# EAGLE schematic Timing_Control_V1p1 (EAGLE 9.6.2)

## Sheet 1 of 3: Main Circuitry
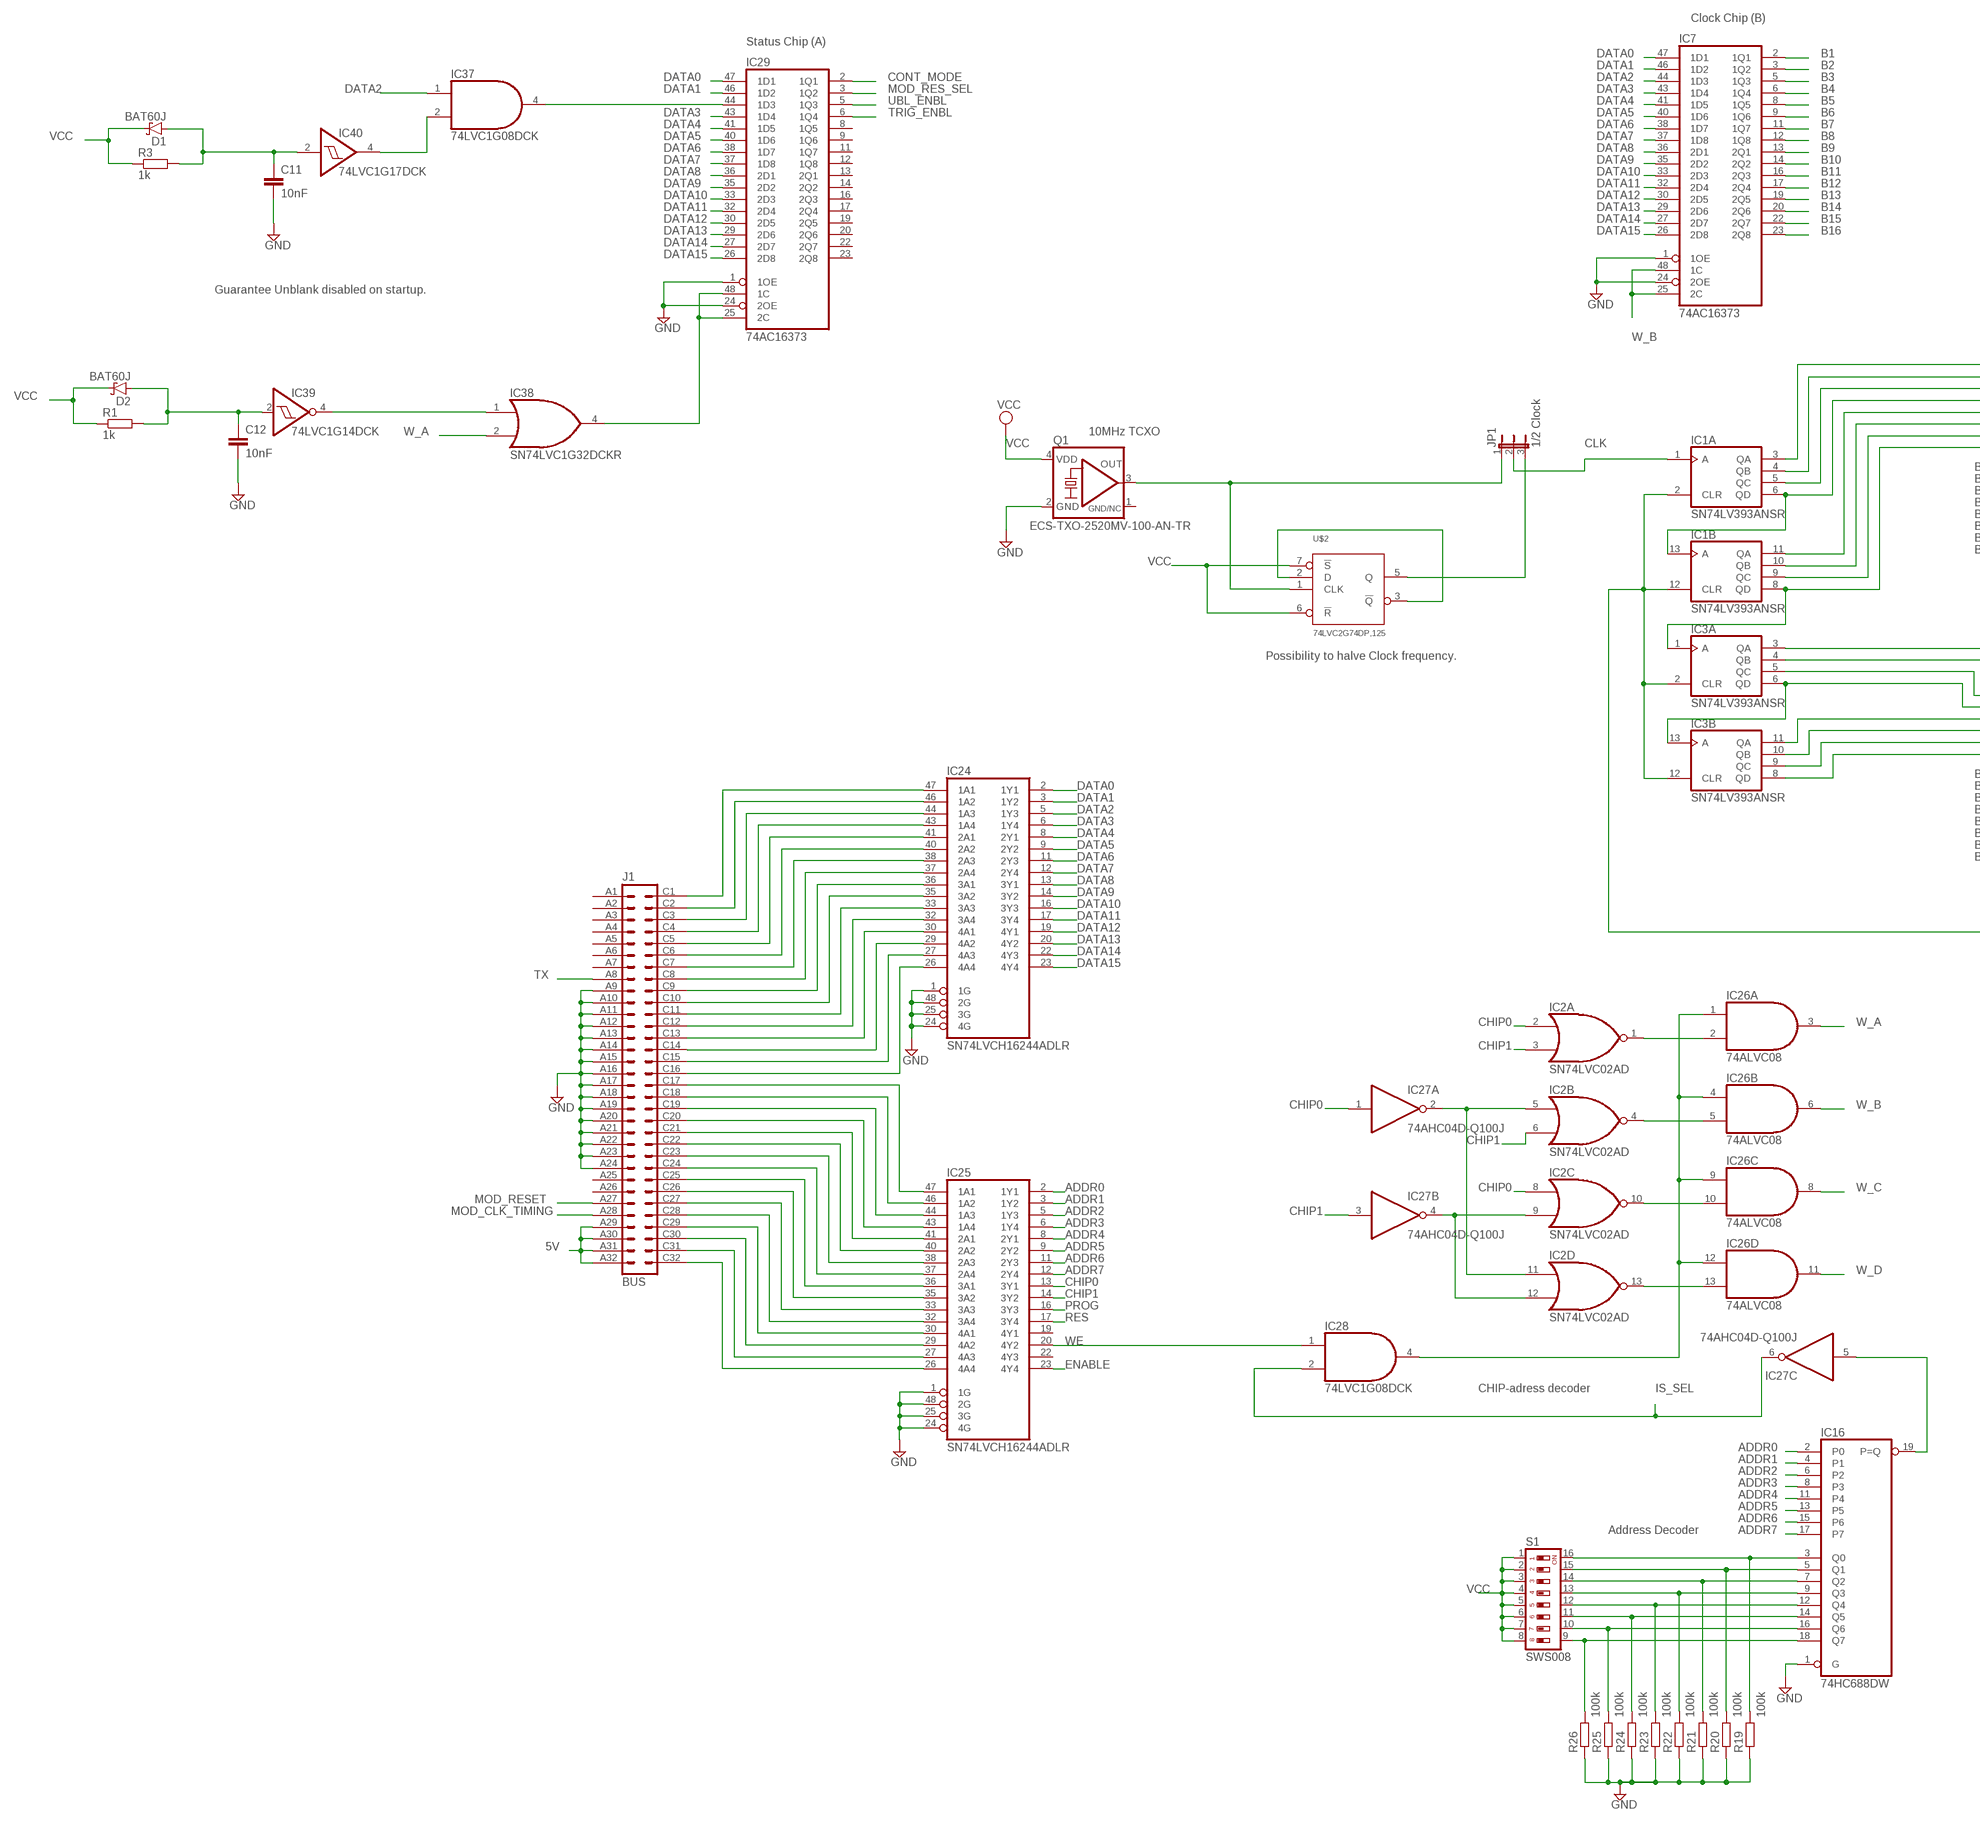
[diagram p0: schematic, sheet 1, part 1 of 3]
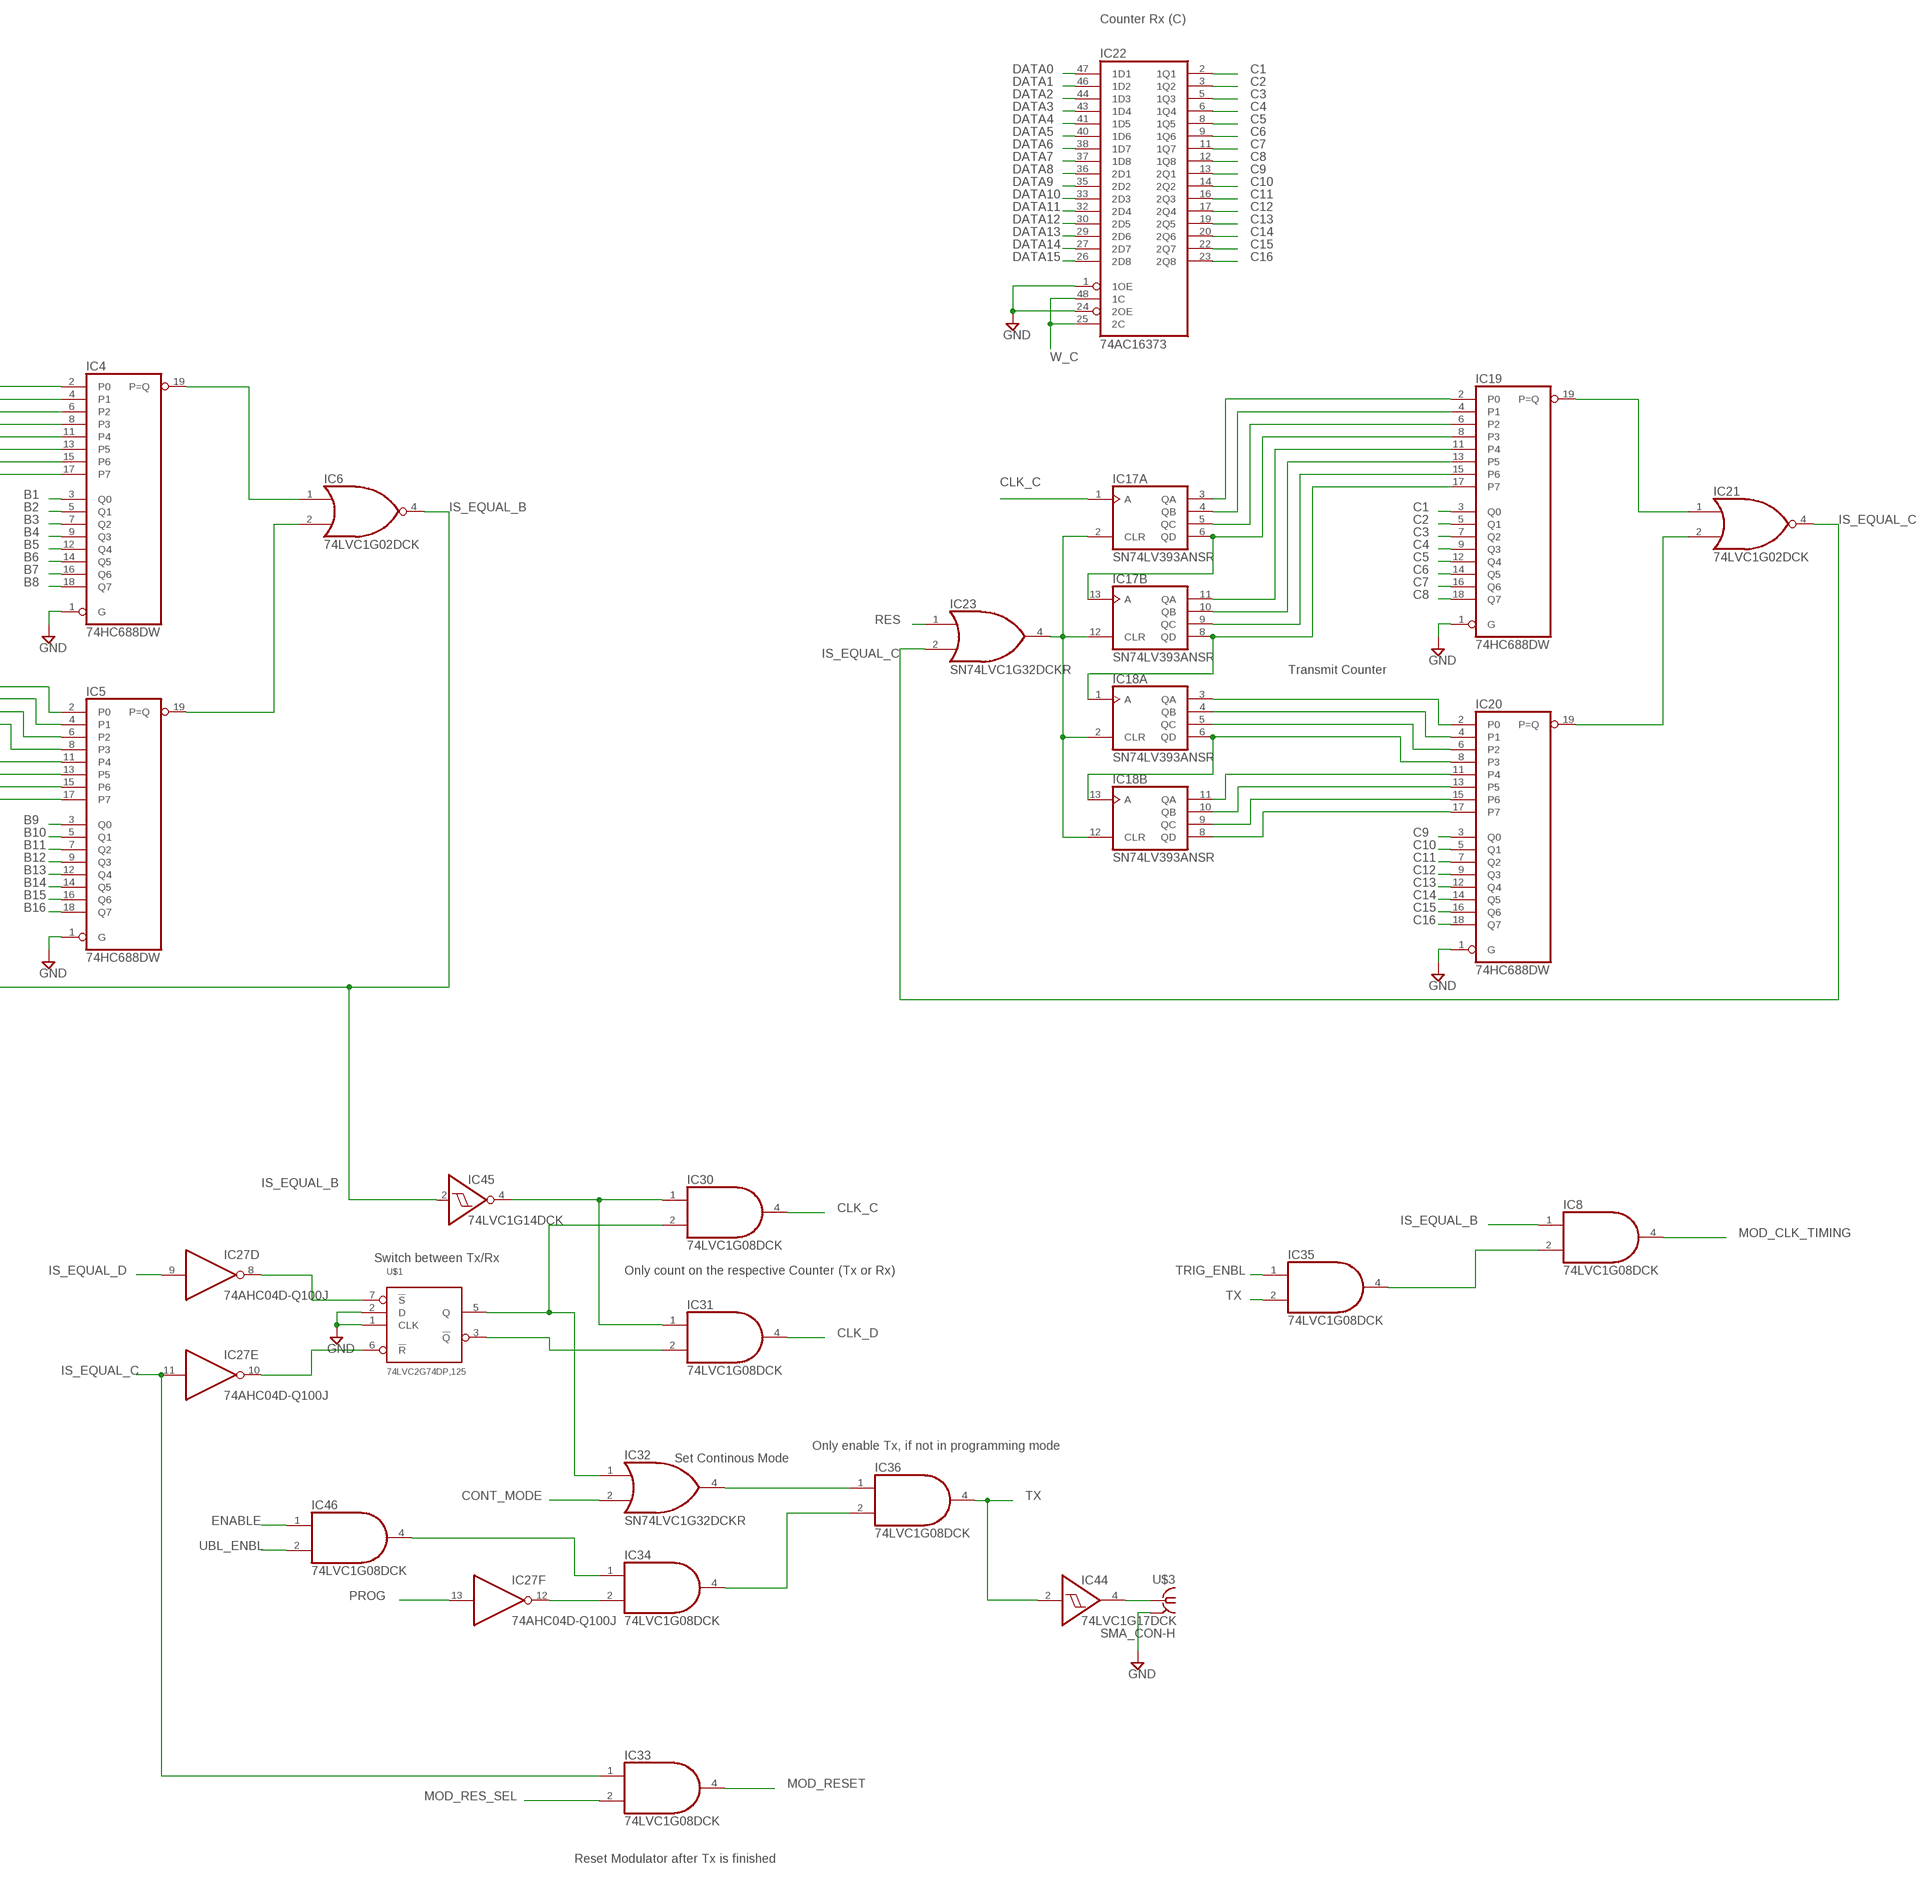
[diagram p1: schematic, sheet 1, part 2 of 3]
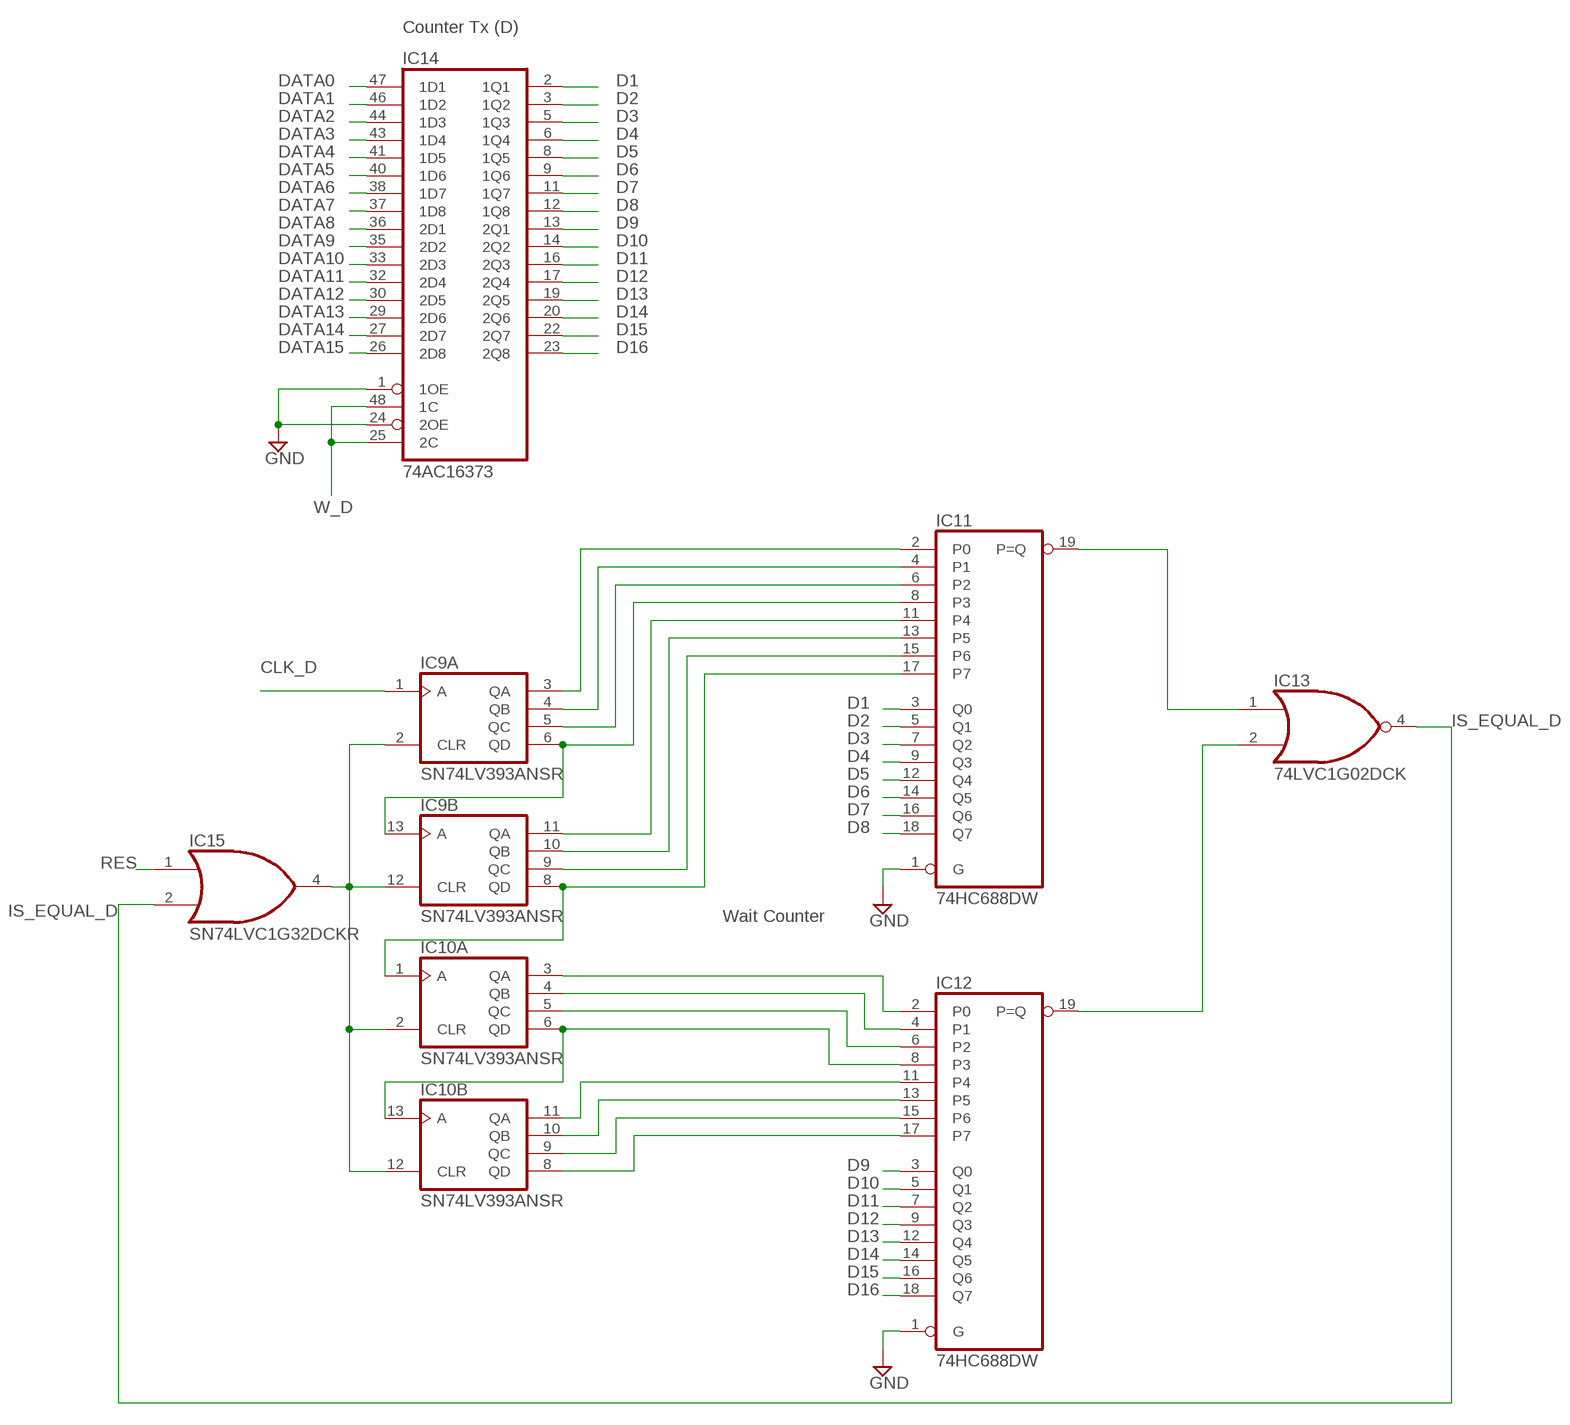
[diagram p2: schematic, sheet 1, part 3 of 3]

### Parts
C11  10nF  C-EUC0603  [C0603]
C12  10nF  C-EUC0603  [C0603]
D1  BAT60J  [SOD323_ST]
D2  BAT60J  [SOD323_ST]
IC1  SN74LV393ANSR  74AC393D  [SO14]
IC2  SN74LVC02AD  74AS02D  [SO14]
IC3  SN74LV393ANSR  74AC393D  [SO14]
IC4  74HC688DW  [SO20W]
IC5  74HC688DW  [SO20W]
IC6  74LVC1G02DCK  [SC70-5]
IC7  74AC16373  [SSOP48DL]
IC8  74LVC1G08DCK  [SC70-5]
IC9  SN74LV393ANSR  74AC393D  [SO14]
IC10  SN74LV393ANSR  74AC393D  [SO14]
IC11  74HC688DW  [SO20W]
IC12  74HC688DW  [SO20W]
IC13  74LVC1G02DCK  [SC70-5]
IC14  74AC16373  [SSOP48DL]
IC15  SN74LVC1G32DCKR  74AUC1G32DCK  [SC70-5]
IC16  74HC688DW  [SO20W]
IC17  SN74LV393ANSR  74AC393D  [SO14]
IC18  SN74LV393ANSR  74AC393D  [SO14]
IC19  74HC688DW  [SO20W]
IC20  74HC688DW  [SO20W]
IC21  74LVC1G02DCK  [SC70-5]
IC22  74AC16373  [SSOP48DL]
IC23  SN74LVC1G32DCKR  74AUC1G32DCK  [SC70-5]
IC24  SN74LVCH16244ADLR  74AC16244  [SSOP48DL]
IC25  SN74LVCH16244ADLR  74AC16244  [SSOP48DL]
IC26  74ALVC08  74ALS08D  [SO14]
IC27  74AHC04D-Q100J  74ALS04D  [SO14]
IC28  74LVC1G08DCK  [SC70-5]
IC29  74AC16373  [SSOP48DL]
IC30  74LVC1G08DCK  [SC70-5]
IC31  74LVC1G08DCK  [SC70-5]
IC32  SN74LVC1G32DCKR  74AUC1G32DCK  [SC70-5]
IC33  74LVC1G08DCK  [SC70-5]
IC34  74LVC1G08DCK  [SC70-5]
IC35  74LVC1G08DCK  [SC70-5]
IC36  74LVC1G08DCK  [SC70-5]
IC37  74LVC1G08DCK  [SC70-5]
IC38  SN74LVC1G32DCKR  74AUC1G32DCK  [SC70-5]
IC39  74LVC1G14DCK  [SC70-5]
IC40  74LVC1G17DCK  [SC70-5]
IC44  74LVC1G17DCK  [SC70-5]
IC45  74LVC1G14DCK  [SC70-5]
IC46  74LVC1G08DCK  [SC70-5]
J1  BUS  VG64P  [VG64P]
JP1  1/2 Clock  JP2E  [JP2]
Q1  ECS-TXO-2520MV-100-AN-TR  KXO-TCXO-CMOS-86  [2.5X2.0_KXO-86-TCXO]
R1  1k  R-EU_R0603  [R0603]
R3  1k  R-EU_R0603  [R0603]
R19  100k  R-EU_R0603  [R0603]
R20  100k  R-EU_R0603  [R0603]
R21  100k  R-EU_R0603  [R0603]
R22  100k  R-EU_R0603  [R0603]
R23  100k  R-EU_R0603  [R0603]
R24  100k  R-EU_R0603  [R0603]
R25  100k  R-EU_R0603  [R0603]
R26  100k  R-EU_R0603  [R0603]
S1  SWS008  [SMS-008]
U$1  74LVC2G74DP,125  74LVC2G74  [SSOP08]
U$2  74LVC2G74DP,125  74LVC2G74  [SSOP08]
U$3  SMA_CON-H  [BU-SMA-H]

### Nets
5V: J1.A29 J1.A30 J1.A31 J1.A32 ; also sheet 3
ADDR0: IC16.2(P0) IC25.2(1Y1)
ADDR1: IC16.4(P1) IC25.3(1Y2)
ADDR2: IC16.6(P2) IC25.5(1Y3)
ADDR3: IC16.8(P3) IC25.6(1Y4)
ADDR4: IC16.11(P4) IC25.8(2Y1)
ADDR5: IC16.13(P5) IC25.9(2Y2)
ADDR6: IC16.15(P6) IC25.11(2Y3)
ADDR7: IC16.17(P7) IC25.12(2Y4)
B1: IC4.3(Q0) IC7.2(1Q1)
B2: IC4.5(Q1) IC7.3(1Q2)
B3: IC4.7(Q2) IC7.5(1Q3)
B4: IC4.9(Q3) IC7.6(1Q4)
B5: IC4.12(Q4) IC7.8(1Q5)
B6: IC4.14(Q5) IC7.9(1Q6)
B7: IC4.16(Q6) IC7.11(1Q7)
B8: IC4.18(Q7) IC7.12(1Q8)
B9: IC5.3(Q0) IC7.13(2Q1)
B10: IC5.5(Q1) IC7.14(2Q2)
B11: IC5.7(Q2) IC7.16(2Q3)
B12: IC5.9(Q3) IC7.17(2Q4)
B13: IC5.12(Q4) IC7.19(2Q5)
B14: IC5.14(Q5) IC7.20(2Q6)
B15: IC5.16(Q6) IC7.22(2Q7)
B16: IC5.18(Q7) IC7.23(2Q8)
C1: IC19.3(Q0) IC22.2(1Q1)
C2: IC19.5(Q1) IC22.3(1Q2)
C3: IC19.7(Q2) IC22.5(1Q3)
C4: IC19.9(Q3) IC22.6(1Q4)
C5: IC19.12(Q4) IC22.8(1Q5)
C6: IC19.14(Q5) IC22.9(1Q6)
C7: IC19.16(Q6) IC22.11(1Q7)
C8: IC19.18(Q7) IC22.12(1Q8)
C9: IC20.3(Q0) IC22.13(2Q1)
C10: IC20.5(Q1) IC22.14(2Q2)
C11: IC20.7(Q2) IC22.16(2Q3)
C12: IC20.9(Q3) IC22.17(2Q4)
C13: IC20.12(Q4) IC22.19(2Q5)
C14: IC20.14(Q5) IC22.20(2Q6)
C15: IC20.16(Q6) IC22.22(2Q7)
C16: IC20.18(Q7) IC22.23(2Q8)
CHIP0: IC2.2(A:I0) IC2.8(C:I0) IC25.13(3Y1) IC27.1(A:I)
CHIP1: IC2.3(A:I1) IC2.6(B:I1) IC25.14(3Y2) IC27.3(B:I)
CLK: IC1.1(A:A) JP1.2
CLK_C: IC17.1(A:A) IC30.4(O)
CLK_D: IC9.1(A:A) IC31.4(O)
CLR1: IC9.2(A:CLR) IC9.12(B:CLR) IC10.2(A:CLR) IC10.12(B:CLR) IC15.4(O)
CLR2: IC17.2(A:CLR) IC17.12(B:CLR) IC18.2(A:CLR) IC18.12(B:CLR) IC23.4(O)
CONT_MODE: IC29.2(1Q1) IC32.2(I1) ; also sheet 2
D1: IC11.3(Q0) IC14.2(1Q1)
D2: IC11.5(Q1) IC14.3(1Q2)
D3: IC11.7(Q2) IC14.5(1Q3)
D4: IC11.9(Q3) IC14.6(1Q4)
D5: IC11.12(Q4) IC14.8(1Q5)
D6: IC11.14(Q5) IC14.9(1Q6)
D7: IC11.16(Q6) IC14.11(1Q7)
D8: IC11.18(Q7) IC14.12(1Q8)
D9: IC12.3(Q0) IC14.13(2Q1)
D10: IC12.5(Q1) IC14.14(2Q2)
D11: IC12.7(Q2) IC14.16(2Q3)
D12: IC12.9(Q3) IC14.17(2Q4)
D13: IC12.12(Q4) IC14.19(2Q5)
D14: IC12.14(Q5) IC14.20(2Q6)
D15: IC12.16(Q6) IC14.22(2Q7)
D16: IC12.18(Q7) IC14.23(2Q8)
DATA0: IC7.47(1D1) IC14.47(1D1) IC22.47(1D1) IC24.2(1Y1) IC29.47(1D1)
DATA1: IC7.46(1D2) IC14.46(1D2) IC22.46(1D2) IC24.3(1Y2) IC29.46(1D2)
DATA2: IC7.44(1D3) IC14.44(1D3) IC22.44(1D3) IC24.5(1Y3) IC37.1(I0)
DATA3: IC7.43(1D4) IC14.43(1D4) IC22.43(1D4) IC24.6(1Y4) IC29.43(1D4)
DATA4: IC7.41(1D5) IC14.41(1D5) IC22.41(1D5) IC24.8(2Y1) IC29.41(1D5)
DATA5: IC7.40(1D6) IC14.40(1D6) IC22.40(1D6) IC24.9(2Y2) IC29.40(1D6)
DATA6: IC7.38(1D7) IC14.38(1D7) IC22.38(1D7) IC24.11(2Y3) IC29.38(1D7)
DATA7: IC7.37(1D8) IC14.37(1D8) IC22.37(1D8) IC24.12(2Y4) IC29.37(1D8)
DATA8: IC7.36(2D1) IC14.36(2D1) IC22.36(2D1) IC24.13(3Y1) IC29.36(2D1)
DATA9: IC7.35(2D2) IC14.35(2D2) IC22.35(2D2) IC24.14(3Y2) IC29.35(2D2)
DATA10: IC7.33(2D3) IC14.33(2D3) IC22.33(2D3) IC24.16(3Y3) IC29.33(2D3)
DATA11: IC7.32(2D4) IC14.32(2D4) IC22.32(2D4) IC24.17(3Y4) IC29.32(2D4)
DATA12: IC7.30(2D5) IC14.30(2D5) IC22.30(2D5) IC24.19(4Y1) IC29.30(2D5)
DATA13: IC7.29(2D6) IC14.29(2D6) IC22.29(2D6) IC24.20(4Y2) IC29.29(2D6)
DATA14: IC7.27(2D7) IC14.27(2D7) IC22.27(2D7) IC24.22(4Y3) IC29.27(2D7)
DATA15: IC7.26(2D8) IC14.26(2D8) IC22.26(2D8) IC24.23(4Y4) IC29.26(2D8)
ENABLE: IC25.23(4Y4) IC46.1(I0)
GND: C11.2 C12.2 IC4.1(G) IC5.1(G) IC7.1(1OE) IC7.24(2OE) IC11.1(G) IC12.1(G) IC14.1(1OE) IC14.24(2OE) IC16.1(G) IC19.1(G) IC20.1(G) IC22.1(1OE) IC22.24(2OE) IC24.1(1G) IC24.24(4G) IC24.25(3G) IC24.48(2G) IC25.1(1G) IC25.24(4G) IC25.25(3G) IC25.48(2G) IC29.1(1OE) IC29.24(2OE) J1.A9 J1.A10 J1.A11 J1.A12 J1.A13 J1.A14 J1.A15 J1.A16 J1.A17 J1.A18 J1.A19 J1.A20 J1.A21 J1.A22 J1.A23 J1.A24 Q1.2(GND) R19.1 R20.1 R21.1 R22.1 R23.1 R24.1 R25.1 R26.1 U$1.1(CLK) U$1.2(D) U$3.2(GND) U$3.3(GND) U$3.4(GND) U$3.5(GND) ; also sheet 2,3
IS_EQUAL_B: IC1.2(A:CLR) IC1.12(B:CLR) IC3.2(A:CLR) IC3.12(B:CLR) IC6.4(O) IC8.1(I0) IC45.2(I)
IS_EQUAL_C: IC21.4(O) IC23.2(I1) IC27.11(E:I) IC33.1(I0)
IS_EQUAL_D: IC13.4(O) IC15.2(I1) IC27.9(D:I)
IS_SEL: IC27.6(C:O) IC28.2(I1) ; also sheet 2
MOD_CLK_TIMING: IC8.4(O) J1.A28
MOD_RES_SEL: IC29.3(1Q2) IC33.2(I1)
MOD_RESET: IC33.4(O) J1.A27
N$1: IC1.6(A:QD) IC1.13(B:A) IC4.8(P3)
N$2: IC1.8(B:QD) IC3.1(A:A) IC4.17(P7)
N$3: IC3.6(A:QD) IC3.13(B:A) IC5.8(P3)
N$4: IC8.2(I1) IC35.4(O)
N$5: IC1.3(A:QA) IC4.2(P0)
N$6: IC1.4(A:QB) IC4.4(P1)
N$7: IC1.5(A:QC) IC4.6(P2)
N$8: IC1.11(B:QA) IC4.11(P4)
N$9: IC1.10(B:QB) IC4.13(P5)
N$10: IC1.9(B:QC) IC4.15(P6)
N$11: IC3.3(A:QA) IC5.2(P0)
N$12: IC3.4(A:QB) IC5.4(P1)
N$13: IC3.5(A:QC) IC5.6(P2)
N$14: IC9.6(A:QD) IC9.13(B:A) IC11.8(P3)
N$15: IC3.11(B:QA) IC5.11(P4)
N$16: IC3.10(B:QB) IC5.13(P5)
N$17: IC3.9(B:QC) IC5.15(P6)
N$18: IC3.8(B:QD) IC5.17(P7)
N$19: IC4.19(P=Q) IC6.1(I0)
N$20: IC5.19(P=Q) IC6.2(I1)
N$21: IC9.8(B:QD) IC10.1(A:A) IC11.17(P7)
N$22: IC10.6(A:QD) IC10.13(B:A) IC12.8(P3)
N$23: IC9.3(A:QA) IC11.2(P0)
N$24: IC9.4(A:QB) IC11.4(P1)
N$25: IC9.5(A:QC) IC11.6(P2)
N$26: IC9.11(B:QA) IC11.11(P4)
N$27: IC9.10(B:QB) IC11.13(P5)
N$28: IC9.9(B:QC) IC11.15(P6)
N$29: IC10.3(A:QA) IC12.2(P0)
N$30: IC10.4(A:QB) IC12.4(P1)
N$31: IC10.5(A:QC) IC12.6(P2)
N$32: IC10.11(B:QA) IC12.11(P4)
N$33: IC10.10(B:QB) IC12.13(P5)
N$34: IC10.9(B:QC) IC12.15(P6)
N$35: IC10.8(B:QD) IC12.17(P7)
N$36: IC11.19(P=Q) IC13.1(I0)
N$37: IC12.19(P=Q) IC13.2(I1)
N$38: IC27.12(F:O) IC34.2(I1)
N$39: IC17.6(A:QD) IC17.13(B:A) IC19.8(P3)
N$40: IC16.3(Q0) R19.2 S1.16
N$41: IC17.8(B:QD) IC18.1(A:A) IC19.17(P7)
N$42: IC18.6(A:QD) IC18.13(B:A) IC20.8(P3)
N$43: IC17.3(A:QA) IC19.2(P0)
N$44: IC17.4(A:QB) IC19.4(P1)
N$45: IC17.5(A:QC) IC19.6(P2)
N$46: IC17.11(B:QA) IC19.11(P4)
N$47: IC17.10(B:QB) IC19.13(P5)
N$48: IC17.9(B:QC) IC19.15(P6)
N$49: IC18.3(A:QA) IC20.2(P0)
N$50: IC18.4(A:QB) IC20.4(P1)
N$51: IC18.5(A:QC) IC20.6(P2)
N$52: IC18.11(B:QA) IC20.11(P4)
N$53: IC18.10(B:QB) IC20.13(P5)
N$54: IC18.9(B:QC) IC20.15(P6)
N$55: IC18.8(B:QD) IC20.17(P7)
N$56: IC19.19(P=Q) IC21.1(I0)
N$57: IC20.19(P=Q) IC21.2(I1)
N$58: IC34.4(O) IC36.2(I1)
N$59: IC24.47(1A1) J1.C1
N$60: IC24.46(1A2) J1.C2
N$61: IC24.44(1A3) J1.C3
N$62: IC24.43(1A4) J1.C4
N$63: IC24.41(2A1) J1.C5
N$64: IC16.5(Q1) R20.2 S1.15
N$65: IC16.7(Q2) R21.2 S1.14
N$66: IC16.9(Q3) R22.2 S1.13
N$67: IC16.12(Q4) R23.2 S1.12
N$68: IC16.14(Q5) R24.2 S1.11
N$69: IC16.16(Q6) R25.2 S1.10
N$70: IC16.18(Q7) R26.2 S1.9
N$71: IC24.40(2A2) J1.C6
N$72: IC24.38(2A3) J1.C7
N$73: IC24.37(2A4) J1.C8
N$74: IC24.36(3A1) J1.C9
N$75: IC24.35(3A2) J1.C10
N$76: IC24.33(3A3) J1.C11
N$77: IC24.32(3A4) J1.C12
N$78: IC24.30(4A1) J1.C13
N$79: IC24.29(4A2) J1.C14
N$80: IC16.19(P=Q) IC27.5(C:I)
N$81: IC24.27(4A3) J1.C15
N$82: IC24.26(4A4) J1.C16
N$83: IC25.47(1A1) J1.C17
N$84: IC25.46(1A2) J1.C18
N$85: IC25.44(1A3) J1.C19
N$86: IC25.43(1A4) J1.C20
N$87: IC25.41(2A1) J1.C21
N$88: IC25.40(2A2) J1.C22
N$89: IC25.38(2A3) J1.C23
N$90: IC25.37(2A4) J1.C24
N$91: IC25.36(3A1) J1.C25
N$92: IC25.35(3A2) J1.C26
N$93: IC25.33(3A3) J1.C27
N$94: IC25.32(3A4) J1.C28
N$95: IC25.30(4A1) J1.C29
N$96: IC25.29(4A2) J1.C30
N$97: IC25.27(4A3) J1.C31
N$98: IC25.26(4A4) J1.C32
N$99: IC2.5(B:I0) IC2.11(D:I0) IC27.2(A:O)
N$100: IC2.9(C:I1) IC2.12(D:I1) IC27.4(B:O)
N$101: IC2.1(A:O) IC26.2(A:I1)
N$102: IC2.4(B:O) IC26.5(B:I1)
N$103: IC2.10(C:O) IC26.10(C:I1)
N$104: IC2.13(D:O) IC26.13(D:I1)
N$105: IC26.1(A:I0) IC26.4(B:I0) IC26.9(C:I0) IC26.12(D:I0) IC28.4(O)
N$107: IC30.2(I1) IC32.1(I0) U$1.5(Q)
N$108: IC31.2(I1) U$1.3(!Q)
N$109: IC27.8(D:O) U$1.7(!S)
N$110: IC27.10(E:O) U$1.6(!R)
N$111: IC32.4(O) IC36.1(I0)
N$112: JP1.1 Q1.3(OUT) U$2.1(CLK)
N$113: IC29.44(1D3) IC37.4(O)
N$114: U$2.2(D) U$2.3(!Q)
N$115: JP1.3 U$2.5(Q)
N$116: IC29.25(2C) IC29.48(1C) IC38.4(O)
N$117: IC37.2(I1) IC40.4(O)
N$118: C11.1 D1.A IC40.2(I) R3.2
N$119: IC38.1(I0) IC39.4(O)
N$120: C12.1 D2.A IC39.2(I) R1.2
N$125: IC34.1(I0) IC46.4(O)
N$127: IC44.4(O) U$3.1
N$1000: IC30.1(I0) IC31.1(I0) IC45.4(O)
PROG: IC25.16(3Y3) IC27.13(F:I)
RES: IC15.1(I0) IC23.1(I0) IC25.17(3Y4)
TRIG_ENBL: IC29.6(1Q4) IC35.1(I0)
TX: IC35.2(I1) IC36.4(O) IC44.2(I) J1.A8 ; also sheet 2
UBL_ENBL: IC29.5(1Q3) IC46.2(I1)
VCC: D1.C D2.C Q1.4(VDD) R1.1 R3.1 S1.1 S1.2 S1.3 S1.4 S1.5 S1.6 S1.7 S1.8 U$2.6(!R) U$2.7(!S) ; also sheet 2,3
W_A: IC26.3(A:O) IC38.2(I1)
W_B: IC7.25(2C) IC7.48(1C) IC26.6(B:O)
W_C: IC22.25(2C) IC22.48(1C) IC26.8(C:O)
W_D: IC14.25(2C) IC14.48(1C) IC26.11(D:O)
WE: IC25.20(4Y2) IC28.1(I0)
Unconnected: IC25.19(4Y1) IC25.22(4Y3) IC29.8(1Q5) IC29.9(1Q6) IC29.11(1Q7) IC29.12(1Q8) IC29.13(2Q1) IC29.14(2Q2) IC29.16(2Q3) IC29.17(2Q4) IC29.19(2Q5) IC29.20(2Q6) IC29.22(2Q7) IC29.23(2Q8) J1.A1 J1.A2 J1.A3 J1.A4 J1.A5 J1.A6 J1.A7 J1.A25 J1.A26

### Notes on the sheet
- Clock Chip (B) | Counter Rx (C)
- Counter Tx (D)
- Status Chip (A)
- Guarantee Unblank disabled on startup.
- 10MHz TCXO
- ECS-TXO-2520MV-100-AN-TR
- Wait Counter
- Transmit Counter
- Possibility to halve Clock frequency.
- Switch between Tx/Rx
- Only count on the respective Counter (Tx or Rx)
- Only enable Tx, if not in programming mode
- Set Continous Mode
- CHIP-adress decoder
- Address Decoder
- Reset Modulator after Tx is finished

## Sheet 2 of 3: Status Lights
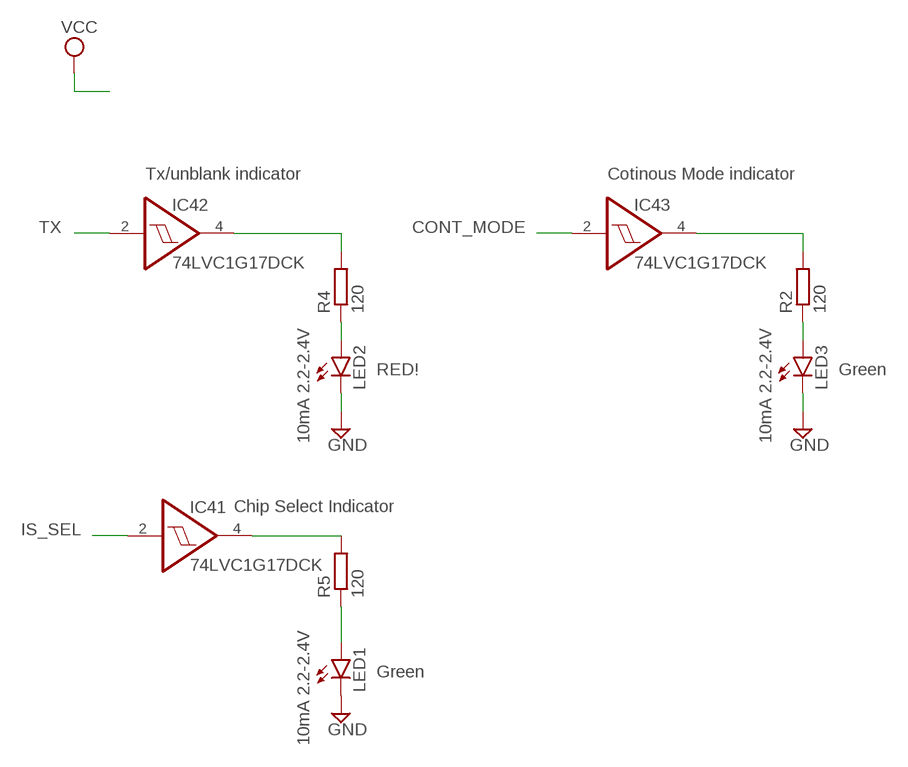
[diagram p3: schematic, sheet 2]

### Parts
IC41  74LVC1G17DCK  [SC70-5]
IC42  74LVC1G17DCK  [SC70-5]
IC43  74LVC1G17DCK  [SC70-5]
LED1  10mA 2.2-2.4V  LED3MM  [LED3MM]
LED2  10mA 2.2-2.4V  LED3MM  [LED3MM]
LED3  10mA 2.2-2.4V  LED3MM  [LED3MM]
R2  120  R-EU_R0603  [R0603]
R4  120  R-EU_R0603  [R0603]
R5  120  R-EU_R0603  [R0603]

### Nets
CONT_MODE: IC43.2(I) ; also sheet 1
GND: LED1.K(C) LED2.K(C) LED3.K(C) ; also sheet 1,3
IS_SEL: IC41.2(I) ; also sheet 1
N$106: IC43.4(O) R2.2
N$121: IC41.4(O) R5.2
N$122: LED1.A R5.1
N$123: LED3.A R2.1
N$124: IC42.4(O) R4.2
N$126: LED2.A R4.1
TX: IC42.2(I) ; also sheet 1

### Notes on the sheet
- Tx/unblank indicator | Cotinous Mode indicator
- RED! | Green
- Chip Select Indicator
- Green

## Sheet 3 of 3: 3.3V Power Supply
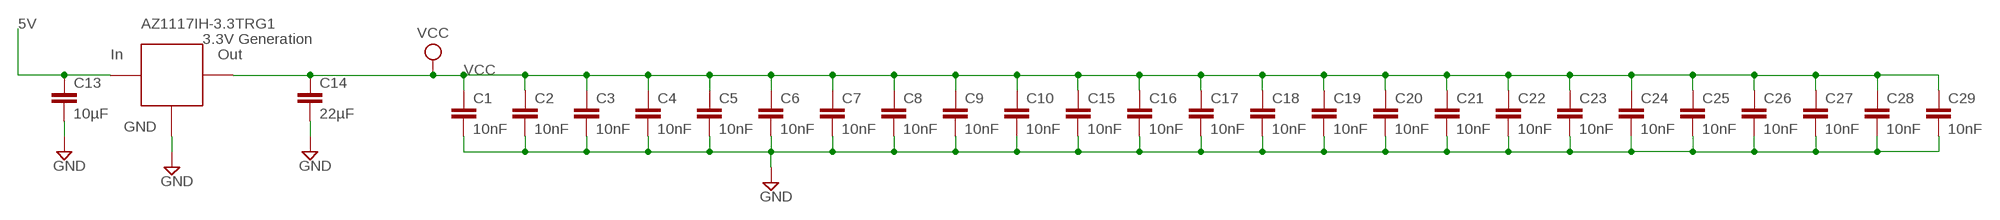
[diagram p4: schematic, sheet 3]

### Parts
C1  10nF  C-EUC0603  [C0603]
C2  10nF  C-EUC0603  [C0603]
C3  10nF  C-EUC0603  [C0603]
C4  10nF  C-EUC0603  [C0603]
C5  10nF  C-EUC0603  [C0603]
C6  10nF  C-EUC0603  [C0603]
C7  10nF  C-EUC0603  [C0603]
C8  10nF  C-EUC0603  [C0603]
C9  10nF  C-EUC0603  [C0603]
C10  10nF  C-EUC0603  [C0603]
C13  10µF  C-EUC1206  [C1206]
C14  22µF  C-EUC1206  [C1206]
C15  10nF  C-EUC0603  [C0603]
C16  10nF  C-EUC0603  [C0603]
C17  10nF  C-EUC0603  [C0603]
C18  10nF  C-EUC0603  [C0603]
C19  10nF  C-EUC0603  [C0603]
C20  10nF  C-EUC0603  [C0603]
C21  10nF  C-EUC0603  [C0603]
C22  10nF  C-EUC0603  [C0603]
C23  10nF  C-EUC0603  [C0603]
C24  10nF  C-EUC0603  [C0603]
C25  10nF  C-EUC0603  [C0603]
C26  10nF  C-EUC0603  [C0603]
C27  10nF  C-EUC0603  [C0603]
C28  10nF  C-EUC0603  [C0603]
C29  10nF  C-EUC0603  [C0603]
U$9  AZ1117IH-3.3TRG1  LT1117  [SOT223]

### Nets
5V: C13.1 U$9.3(IN) ; also sheet 1
GND: C1.2 C2.2 C3.2 C4.2 C5.2 C6.2 C7.2 C8.2 C9.2 C10.2 C13.2 C14.2 C15.2 C16.2 C17.2 C18.2 C19.2 C20.2 C21.2 C22.2 C23.2 C24.2 C25.2 C26.2 C27.2 C28.2 C29.2 U$9.1(GND) ; also sheet 1,2
VCC: C1.1 C2.1 C3.1 C4.1 C5.1 C6.1 C7.1 C8.1 C9.1 C10.1 C14.1 C15.1 C16.1 C17.1 C18.1 C19.1 C20.1 C21.1 C22.1 C23.1 C24.1 C25.1 C26.1 C27.1 C28.1 C29.1 U$9.2(VCC) U$9.4(VCC) ; also sheet 1,2

### Notes on the sheet
- 3.3V Generation

## Power pins joined to a net without a drawn wire
GND: IC1.7(P:GND) IC2.7(P:GND) IC3.7(P:GND) IC4.10(GND) IC5.10(GND) IC6.3(GND) IC7.4(GND) IC7.10(GND) IC7.15(GND) IC7.21(GND) IC7.28(GND) IC7.34(GND) IC7.39(GND) IC7.45(GND) IC8.3(GND) IC9.7(P:GND) IC10.7(P:GND) IC11.10(GND) IC12.10(GND) IC13.3(GND) IC14.4(GND) IC14.10(GND) IC14.15(GND) IC14.21(GND) IC14.28(GND) IC14.34(GND) IC14.39(GND) IC14.45(GND) IC15.3(GND) IC16.10(GND) IC17.7(P:GND) IC18.7(P:GND) IC19.10(GND) IC20.10(GND) IC21.3(GND) IC22.4(GND) IC22.10(GND) IC22.15(GND) IC22.21(GND) IC22.28(GND) IC22.34(GND) IC22.39(GND) IC22.45(GND) IC23.3(GND) IC24.4(GND) IC24.10(GND) IC24.15(GND) IC24.21(GND) IC24.28(GND) IC24.34(GND) IC24.39(GND) IC24.45(GND) IC25.4(GND) IC25.10(GND) IC25.15(GND) IC25.21(GND) IC25.28(GND) IC25.34(GND) IC25.39(GND) IC25.45(GND) IC26.7(P:GND) IC27.7(P:GND) IC28.3(GND) IC29.4(GND) IC29.10(GND) IC29.15(GND) IC29.21(GND) IC29.28(GND) IC29.34(GND) IC29.39(GND) IC29.45(GND) IC30.3(GND) IC31.3(GND) IC32.3(GND) IC33.3(GND) IC34.3(GND) IC35.3(GND) IC36.3(GND) IC37.3(GND) IC38.3(GND) IC39.3(GND) IC40.3(GND) IC41.3(GND) IC42.3(GND) IC43.3(GND) IC44.3(GND) IC45.3(GND) IC46.3(GND) U$1.4(GND) U$2.4(GND)
GND/NC: Q1.1(GND/NC)
VCC: IC1.14(P:VCC) IC2.14(P:VCC) IC3.14(P:VCC) IC4.20(VCC) IC5.20(VCC) IC6.5(VCC) IC7.7(VCC) IC7.18(VCC) IC7.31(VCC) IC7.42(VCC) IC8.5(VCC) IC9.14(P:VCC) IC10.14(P:VCC) IC11.20(VCC) IC12.20(VCC) IC13.5(VCC) IC14.7(VCC) IC14.18(VCC) IC14.31(VCC) IC14.42(VCC) IC15.5(VCC) IC16.20(VCC) IC17.14(P:VCC) IC18.14(P:VCC) IC19.20(VCC) IC20.20(VCC) IC21.5(VCC) IC22.7(VCC) IC22.18(VCC) IC22.31(VCC) IC22.42(VCC) IC23.5(VCC) IC24.7(VCC) IC24.18(VCC) IC24.31(VCC) IC24.42(VCC) IC25.7(VCC) IC25.18(VCC) IC25.31(VCC) IC25.42(VCC) IC26.14(P:VCC) IC27.14(P:VCC) IC28.5(VCC) IC29.7(VCC) IC29.18(VCC) IC29.31(VCC) IC29.42(VCC) IC30.5(VCC) IC31.5(VCC) IC32.5(VCC) IC33.5(VCC) IC34.5(VCC) IC35.5(VCC) IC36.5(VCC) IC37.5(VCC) IC38.5(VCC) IC39.5(VCC) IC40.5(VCC) IC41.5(VCC) IC42.5(VCC) IC43.5(VCC) IC44.5(VCC) IC45.5(VCC) IC46.5(VCC) U$1.8(VCC) U$2.8(VCC)

## Library data of the parts
C1-C29 = rcl:C-EU: CAPACITOR, European symbol; SPICEPREFIX: C
D1 D2 = diode:BAT60J: Schottky barrier diode Source: www.st.com, BAT60J.pdf
IC1 IC3 IC9 IC10 IC17 IC18 = 74xx-eu:74*393: Dual 4-bit decade and binary COUNTER
IC2 = 74xx-us:74*02: Quad 2-input NOR gate
IC4 IC5 IC11 IC12 IC16 IC19 IC20 = 74xx-eu:74*688: 8-bit MAGNITUDE/IDENTITY COMPARATOR, totem pole
IC6 IC13 IC21 = 74xx-little-us:74*1G02: 2-input NOR gate
IC7 IC14 IC22 IC29 = 74ac-logic:74AC16373: 16-bit transparent D-type LATCH, 3-state
IC8 IC28 IC30 IC31 IC33-IC37 IC46 = 74xx-little-us:74*1G08: 2-input AND gate
IC15 IC23 IC32 IC38 = 74xx-little-us:74*1G32: 2-input OR gate
IC24 IC25 = 74ac-logic:74AC16244: 16-bit BUFFER/LINE DRIVER, 3-state
IC26 = 74xx-us:74*08: Quad 2-input AND gate
IC27 = 74xx-us:74*04: Hex INVERTER
IC39 IC45 = 74xx-little-de:74*1G14: Single Schmitt-Trigger Inverter Gate
IC40-IC44 = 74xx-little-de:74*1G17: Single Schmitt-Trigger Buffer
J1 = 19inch:VG64: PCB EUROCARD, 64-pin type C/AC, 2.54 mm
JP1 = jumper:JP2E: JUMPER
LED1-LED3 = led:LED: LED OSRAM: - CHIPLED LG R971, LG N971, LY N971, LG Q971, LY Q971, LO R971, LY R971 LH N974, LH R974 LS Q976, LO Q976, LY Q976 LO Q996 - Hyper CHIPLED LW Q18S LB Q993, LB Q99A, LB R99A - SideLED LS A670, LO A670, LY A670, LG A670, LP A670 LB A673, LV A673, LT A673, LW A673 LH A674 LY A675 LS A676, LA A676, LO A676, LY A676, LW A676 LS A679, LY A679, LG A679 - Hyper Micro SIDELED® LS Y876, LA Y876, LO Y876, LY Y876 LT Y87S - SmartLED LW L88C, LW L88S LB L89C, LB L89S, LG L890 LS L89K, LO L89K, LY L89K LS L896, LA L896, LO L896, LY L896 - TOPLED LS T670, LO T670, LY T670, LG T670, LP T670 LSG T670, LSP T670, LSY T670, LOP T670, LYG T670 LG T671, LOG T671, LSG T671 LB T673, LV T673, LT T673, LW T673 LH T674 LS T676, LA T676, LO T676, LY T676, LB T676, LH T676, LSB T676, LW T676 LB T67C, LV T67C, LT T67C, LS T67K, LO T67K, LY T67K, LW E67C LS E67B, LA E67B, LO E67B, LY E67B, LB E67C, LV E67C, LT E67C LW T67C LS T679, LY T679, LG T679 LS T770, LO T770, LY T770, LG T770, LP T770 LB T773, LV T773, LT T773, LW T773 LH T774 LS E675, LA E675, LY E675, LS T675 LS T776, LA T776, LO T776, LY T776, LB T776 LHGB T686 LT T68C, LB T68C - Hyper Mini TOPLED® LB M676 - Mini TOPLED Santana® LG M470 LS M47K, LO M47K, LY M47K Source: http://www.osram.convergy.de LUXEON: - LUMILED® LXK2-PW12-R00, LXK2-PW12-S00, LXK2-PW14-U00, LXK2-PW14-V00 LXK2-PM12-R00, LXK2-PM12-S00, LXK2-PM14-U00 LXK2-PE12-Q00, LXK2-PE12-R00, LXK2-PE12-S00, LXK2-PE14-T00, LXK2-PE14-U00 LXK2-PB12-K00, LXK2-PB12-L00, LXK2-PB12-M00, LXK2-PB14-N00, LXK2-PB14-P00, LXK2-PB14-Q00 LXK2-PR12-L00, LXK2-PR12-M00, LXK2-PR14-Q00, LXK2-PR14-R00 LXK2-PD12-Q00, LXK2-PD12-R00, LXK2-PD12-S00 LXK2-PH12-R00, LXK2-PH12-S00 LXK2-PL12-P00, LXK2-PL12-Q00, LXK2-PL12-R00 Source: www.luxeon.com KINGBRIGHT: KA-3528ASYC Source: www.kingbright.com
Q1 = crystal-geyer_V1_0:KXO-TCXO-CMOS: TCXO : CMOS - Serie Model Size l/w/h [mm] Frequency Range Frequency Stability Temp. Range [°C] Output AECQ 200 availabel Datasheet KXO-86 KXO-84 KXO-83 KXO-82 2.5/2.0/0.7 3.2/2.5/1.0 5.0/3.2/1.5 7.0/5.0/2.4 13,0 ~ 40,0 MHz 10,0 ~ 40,0 MHz 10,0 ~ 40,0 MHz 10,0 ~ 30,0 MHz ±1,0 … ±2,5ppm ±1,0 … ±2,5ppm ±1,0 … ±3,0ppm ±1,0 … ±3,0ppm (*) -30°C …+75°C (*) -40°C …+85°C (*) -40°C …+85°C (*) -30°C …+80°C CMOS CMOS CMOS CMOS - - - - KXO-86.pdf <http://www.geyer-electronic.de/uploads/tx_userartikelfrequenz/GEYER-KXO-86-TCXO-HCMOS.pdf> KXO-84.pdf <http://www.geyer-electronic.de/uploads/tx_userartikelfrequenz/GEYER-KXO-84-TCXO-HCMOS.pdf> KXO-83.pdf <http://www.geyer-electronic.de/uploads/tx_userartikelfrequenz/GEYER-KXO-83-TCXO-HCMOS.pdf> KXO-82.pdf <http://www.geyer-electronic.de/uploads/tx_userartikelfrequenz/GEYER-KXO-82-TCXO-HCMOS.pdf> <http://www.geyer-electronic.de/fileadmin/template/img/logo-geyer-electronic.png> Details see: http://www.geyer-electronic.de/Frequenz-Produkte.9.0.html Created 2016-06-07, Hans Locher 2016 (C) Geyer Quartz Technology KXO86,KXO84,KXO83,KXO82;2550;3225;5032;7050;2,5x2,0;3,2x2,5;2.5x2.0;3.2x2.5,5,0x3,2;7,0x5,0,5.0x3.2,7.0x5.0
R1-R5 R19-R26 = rcl:R-EU_: RESISTOR, European symbol; SPICEPREFIX: R
S1 = smd-special:SWS008: SMD Dip Switch 8 pol.
U$1 U$2 = Orzada:74LVC2G74
U$3 = Orzada:SMA_CON
U$9 = Orzada:LT1117